# Altium project WiWi_USBStick.PrjPcb (part 2 of 5)

## Sheet 04-AT86RF215IQ.SchDoc
size B; SheetNumber: 5; SheetTotal: 14
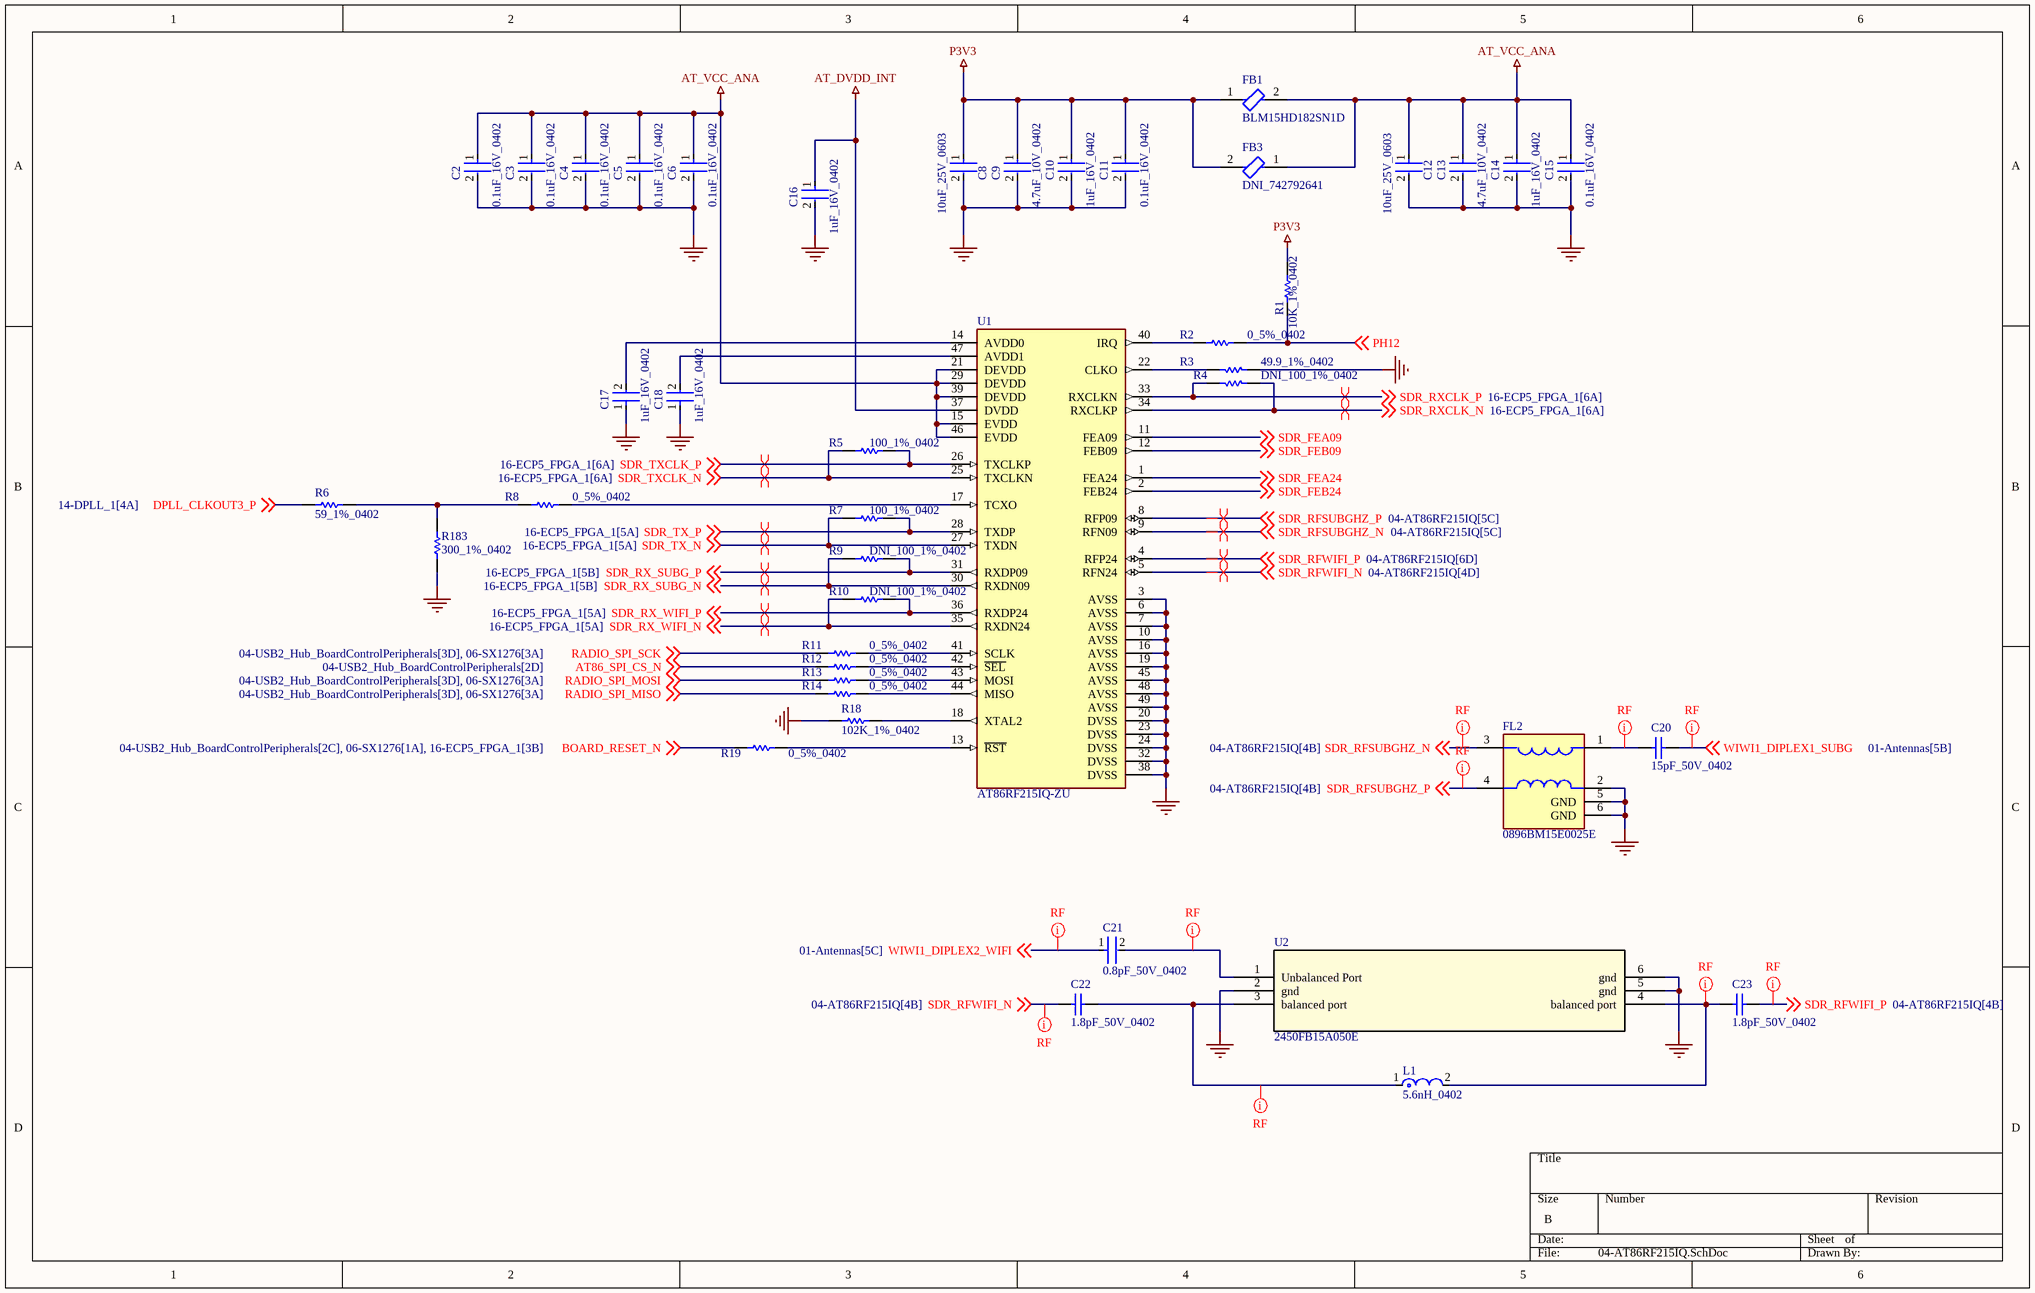
[diagram p4: 04-AT86RF215IQ.SchDoc]

### Parts
C2  0.1uF_16V_0402  [FP-C0402-BB-MFG]
C3  0.1uF_16V_0402  [FP-C0402-BB-MFG]
C4  0.1uF_16V_0402  [FP-C0402-BB-MFG]
C5  0.1uF_16V_0402  [FP-C0402-BB-MFG]
C6  0.1uF_16V_0402  [FP-C0402-BB-MFG]
C8  10uF_25V_0603  [FP-CL10-IPC_C]
C9  4.7uF_10V_0402  [FP-C1005-050-0_15-MFG]
C10  1uF_16V_0402  [FP-0402-L_1_0_0_05-W_0_5-IPC_A]
C11  0.1uF_16V_0402  [FP-C0402-BB-MFG]
C12  10uF_25V_0603  [FP-CL10-IPC_C]
C13  4.7uF_10V_0402  [FP-C1005-050-0_15-MFG]
C14  1uF_16V_0402  [FP-0402-L_1_0_0_05-W_0_5-IPC_A]
C15  0.1uF_16V_0402  [FP-C0402-BB-MFG]
C16  1uF_16V_0402  [FP-0402-L_1_0_0_05-W_0_5-IPC_A]
C17  1uF_16V_0402  [FP-0402-L_1_0_0_05-W_0_5-IPC_A]
C18  1uF_16V_0402  [FP-0402-L_1_0_0_05-W_0_5-IPC_A]
C20  15pF_50V_0402  [CAPC1005X55X25NL05T10]
C21  0.8pF_50V_0402  [FP-GJM155-0_05-IPC_A]
C22  1.8pF_50V_0402  [CAPC1005X55X25LL05T10]
C23  1.8pF_50V_0402  [CAPC1005X55X25LL05T10]
FB1  BLM15HD182SN1D  [FP-BLM15-0_05-MFG]
FB3  DNI_742792641  [FP-742792641-MFG]  (no BOM)
FL2  0896BM15E0025E  [FP-0896BM15E0025E-MFG]
L1  5.6nH_0402  [FP-LQG15HH_02-IPC_A]
R1  10K_1%_0402  [RESC1005X40X25NL10T10]
R2  0_5%_0402  [RESC1005X40X25NL05T10]
R3  49.9_1%_0402  [RESC1005X40X25NL10T10]
R4  DNI_100_1%_0402  [RESC1005X40X25NL05T10]  (no BOM)
R5  100_1%_0402  [RESC1005X40X25NL05T10]
R6  59_1%_0402  [RESC1005X40X25ML10T10]
R7  100_1%_0402  [RESC1005X40X25NL05T10]
R8  0_5%_0402  [RESC1005X40X25NL05T10]
R9  DNI_100_1%_0402  [RESC1005X40X25NL05T10]  (no BOM)
R10  DNI_100_1%_0402  [RESC1005X40X25NL05T10]  (no BOM)
R11  0_5%_0402  [RESC1005X40X25NL05T10]
R12  0_5%_0402  [RESC1005X40X25NL05T10]
R13  0_5%_0402  [RESC1005X40X25NL05T10]
R14  0_5%_0402  [RESC1005X40X25NL05T10]
R18  102K_1%_0402  [RESC1005X40X25ML05T10]
R19  0_5%_0402  [RESC1005X40X25NL05T10]
R183  300_1%_0402  [RESC1005X40X25LL10T10]
U1  AT86RF215IQ-ZU  [FP-AT86RF215IQ-ZU-MFG]
U2  2450FB15A050E  [2450FB15A050E_JOT]

### Nets
AT_DVDD_INT: C16.1 U1.37(DVDD)
AT_VCC_ANA: C2.1 C3.1 C4.1 C5.1 C6.1 C12.1 C13.1 C14.1 C15.1 FB1.2 FB3.1 U1.15(EVDD) U1.21(DEVDD) U1.29(DEVDD) U1.39(DEVDD) U1.46(EVDD)
GND: C2.2 C3.2 C4.2 C5.2 C6.2 C8.2 C9.2 C10.2 C11.2 C12.2 C13.2 C14.2 C15.2 C16.2 C17.1 C18.1 FL2.2(GND) FL2.5(GND) FL2.6(GND) R3.2 R18.1 R183.1 U1.3(AVSS) U1.6(AVSS) U1.7(AVSS) U1.10(AVSS) U1.16(AVSS) U1.19(AVSS) U1.20(DVSS) U1.23(DVSS) U1.24(DVSS) U1.32(DVSS) U1.38(DVSS) U1.45(AVSS) U1.48(AVSS) U1.49(AVSS) U2.2(gnd) U2.5(gnd) U2.6(gnd)
P3V3: C8.1 C9.1 C10.1 C11.1 FB1.1 FB3.2 R1.2
AT86_SPI_CS_N: R12.1 ; off-sheet AT86_SPI_CS_N
BOARD_RESET_N: R19.1 ; off-sheet BOARD_RESET_N
DPLL_CLKOUT3_P: R6.1 ; off-sheet DPLL_CLKOUT3_P
PH12: R1.1 R2.2 ; off-sheet PH12
RADIO_SPI_MISO: R14.1 ; off-sheet RADIO_SPI_MISO
RADIO_SPI_MOSI: R13.1 ; off-sheet RADIO_SPI_MOSI
RADIO_SPI_SCK: R11.1 ; off-sheet RADIO_SPI_SCK
SDR_FEA09: U1.11(FEA09) ; off-sheet SDR_FEA09
SDR_FEA24: U1.1(FEA24) ; off-sheet SDR_FEA24
SDR_FEB09: U1.12(FEB09) ; off-sheet SDR_FEB09
SDR_FEB24: U1.2(FEB24) ; off-sheet SDR_FEB24
SDR_RFSUBGHZ_N: FL2.3(1_Balanced_Port) U1.9(RFN09) ; off-sheet SDR_RFSUBGHZ_N
SDR_RFSUBGHZ_P: FL2.4(2_Balanced_Port) U1.8(RFP09) ; off-sheet SDR_RFSUBGHZ_P
SDR_RFWIFI_N: C22.1 U1.5(RFN24) ; off-sheet SDR_RFWIFI_N
SDR_RFWIFI_P: C23.2 U1.4(RFP24) ; off-sheet SDR_RFWIFI_P
SDR_RX_SUBG_N: R9.1 U1.30(RXDN09) ; off-sheet SDR_RX_SUBG_N
SDR_RX_SUBG_P: R9.2 U1.31(RXDP09) ; off-sheet SDR_RX_SUBG_P
SDR_RX_WIFI_N: R10.1 U1.35(RXDN24) ; off-sheet SDR_RX_WIFI_N
SDR_RX_WIFI_P: R10.2 U1.36(RXDP24) ; off-sheet SDR_RX_WIFI_P
SDR_RXCLK_N: R4.1 U1.34(RXCLKP) ; off-sheet SDR_RXCLK_N
SDR_RXCLK_P: R4.2 U1.33(RXCLKN) ; off-sheet SDR_RXCLK_P
SDR_TX_N: R7.1 U1.27(TXDN) ; off-sheet SDR_TX_N
SDR_TX_P: R7.2 U1.28(TXDP) ; off-sheet SDR_TX_P
SDR_TXCLK_N: R5.1 U1.25(TXCLKN) ; off-sheet SDR_TXCLK_N
SDR_TXCLK_P: R5.2 U1.26(TXCLKP) ; off-sheet SDR_TXCLK_P
WIWI1_DIPLEX1_SUBG: C20.2 ; off-sheet WIWI1_DIPLEX1_SUBG
WIWI1_DIPLEX2_WIFI: C21.1 ; off-sheet WIWI1_DIPLEX2_WIFI
NetC17_2: C17.2 U1.14(AVDD0)
NetC18_2: C18.2 U1.47(AVDD1)
NetC20_1: C20.1 FL2.1(Unbalanced_Port)
NetC21_2: C21.2 U2.1(Unbalanced_Port)
NetC22_2: C22.2 L1.1 U2.3(balanced_port)
NetC23_1: C23.1 L1.2 U2.4(balanced_port)
NetR2_1: R2.1 U1.40(IRQ)
NetR3_1: R3.1 U1.22(CLKO)
NetR6_2: R6.2 R8.1 R183.2
NetR8_2: R8.2 U1.17(TCXO)
NetR11_2: R11.2 U1.41(SCLK)
NetR12_2: R12.2 U1.42(~{SEL})
NetR13_2: R13.2 U1.43(MOSI)
NetR14_2: R14.2 U1.44(MISO)
NetR18_2: R18.2 U1.18(XTAL2)
NetR19_2: R19.2 U1.13(~{RST})

### Layout directives
differential pair: SDR_RFSUBGHZ_N, SDR_RFSUBGHZ_P, SDR_RFWIFI_N, SDR_RFWIFI_P, SDR_RX_SUBG_N, SDR_RX_SUBG_P, SDR_RX_WIFI_N, SDR_RX_WIFI_P, SDR_RXCLK_N, SDR_RXCLK_P, SDR_TX_N, SDR_TX_P, SDR_TXCLK_N, SDR_TXCLK_P
net class RF: NetC20_1, NetC21_2, NetC22_2, NetC23_1, SDR_RFSUBGHZ_N, SDR_RFSUBGHZ_P, SDR_RFWIFI_N, SDR_RFWIFI_P, WIWI1_DIPLEX1_SUBG, WIWI1_DIPLEX2_WIFI

### Library data of the parts
C2-C6 C11 C15 = CMP-1034-02068-3: as C68 on sheet 02-USB3; ComponentLink2URL: https://content.kemet.com/datasheets/KEM_C1002_X7R_SMD.pdf; Automotive: No; Device Class L2: Capacitors; Temperature: -55°C to +125°C; RoHS: TRUE; Voltage Rating: 16 V; ComponentLink2Description: Datasheet; Device Class L3: Ceramic Capacitors; Temperature Range Low: -55°C; Ipc Land Pattern Name: CAPC10050X50; Device Class L1: Passive Components; Temperature Range High: +125°C; Package: C0402-BB; Capacitance: 0.10 μF; Category: Cap; Mouser Description: CAP CER 0.1UF 16V X7R 0402; Height: 0.55mm; Digikey Description: CAP CER 0.1UF 16V 5% X7R 0402; Octopart: https://octopart.com/c0402c104j4ractu-kemet-12573893; Temperature Characteristic: X7R; Lead Free: Yes
C8 C12 = CMP-13271-004224-1: Cap Ceramic 10uF 25V X5R ±20% Pad SMD 0603 +85°C T/R; Width: 0.031inch; Voltage Rating: 25V; Length: 0.063inch; Case Code (Metric): 1608; Dielectric: X5R; Termination: Wraparound; Capacitance: 10uF; Lead Free: Lead Free; Mount: Surface Mount; Package Quantity: 1; Case Code (Imperial): 0603; Thickness: 0.035inch; Packaging: Tape and Reel; Contact Plating: Tin; Min Operating Temperature: -55°C; Tolerance: 20%; Max Operating Temperature: 85°C; Case/Package: 0603
C9 C13 = CMP-2000-05997-2: CAP CER 4.7UF 10V X5R 0402; Dielectric Material: Ceramic; Tolerance: 10%; Series: C; Package Quantity: 10000; Max Operating Temperature: 85°C; Case Code (Imperial): 0402; Lead Free: Lead Free; Voltage Rating (DC): 10V; Packaging: Cut Tape; Voltage Rating: 10V; Min Operating Temperature: -55°C; Dielectric: X5R; Thickness: 0.022inch; Width: 0.02inch; Case/Package: 0402; Case Code (Metric): 1005; Capacitance: 4.7uF; Length: 0.039inch; RoHS Compliant: Yes; REACH SVHC: No SVHC; Mount: Surface Mount
C10 C14 C16-C18 = CMP-14477-000104-2: None; Tolerance: 10%; Voltage Rating: 16V; Dielectric: X5R; Capacitance: 1uF; Packaging: Tape and Reel; Depth: 0.5mm; Mount: Surface Mount; Thickness: 0.022inch; Package Quantity: 1; Min Operating Temperature: -55°C; Series: M; Voltage Rating (DC): 16V; Termination: SMD/SMT; Case/Package: 0402; Number of Pins: 2; Case Code (Imperial): 0402; Length: 1mm; Halogen Free: Halogen Free; Case Code (Metric): 1005; Width: 0.02inch; RoHS Compliant: Yes; Radiation Hardening: No; Max Operating Temperature: 85°C; Height: 0.5mm; Construction: Flat
C20 = CMP-2008-04267-1: Part Number: GRM1555C1H150JZ01D; Manufacturer: Murata
C21 = CMP-2008-03912-2: Multi-Layer Ceramic Capacitor 0.8pF C0G  ±0.1pF 0402 Paper T/R; Voltage: 50V; Height: 0.5mm; Min Operating Temperature: -55°C; Mount: Surface Mount; Length: 1mm; Packaging: Tape and Reel; Package Quantity: 1; Max Operating Temperature: 125°C; Dielectric: C0G; Case Code (Imperial): 0402; Voltage Rating (DC): 50V; Voltage Rating: 50V; Case Code (Metric): 1005; Depth: 0.5mm; Case/Package: 0402; Width: 0.02inch; Termination: SMD/SMT; Thickness: 0.022inch; Capacitance: 0.8pF; Radiation Hardening: No; Lead Free: Lead Free
C22 C23 = CMP-2008-03916-1: Part Number: GRM1555C1H1R8CA01D; Manufacturer: Murata
FB1 = CMP-0686-00276-4: Chip Ferrite Bead, 0402, 1800Ω @ 100MHz, 2.2Ω, 25%, 200mA; Impedance: 1.8kR; Number of Lines: 1; DC Resistance (DCR): 2.2R; Lead Free: Lead Free; Material: Ferrite; REACH SVHC: No SVHC; Current Rating: 200mA; Length: 1mm; Width: 0.5mm; Depth: 0.5mm; Max Operating Temperature: 125°C; Max DC Current: 200mA; Max Current Rating: 200mA; Case Code (Metric): 1005; Package Quantity: 1; Radiation Hardening: No; Number of Pins: 2; Tolerance: 25%; Number of Circuits: 1; Test Frequency: 100MHz; Termination: SMD/SMT; Military Standard: Not; Core Material: Ferrite; Height: 0.5mm; Case Code (Imperial): 0402; Packaging: Tape and Reel; Case/Package: 0402; DC Current: 200mA; Min Operating Temperature: -55°C
FB3 = CMP-0220-00171-2: FERRITE BEAD 300 OHM 0603 1LN; Inductance: 18nH; Max DC Current: 2A; Number of Lines: 1; Test Frequency: 100MHz; Impedance: 300R; DC Resistance (DCR): 150mR; Tolerance: 25%; Case Code (Metric): 1608; Core Material: Ferrite; Length: 1.6mm; Lead Free: Lead Free; Series: WE-CBF; Min Operating Temperature: -55°C; RoHS Compliant: Yes; Case/Package: SMD/SMT; Material: Ferrite; Max Operating Temperature: 125°C; Termination: SMD/SMT; Packaging: Tape and Reel; Weight: 0.000141oz; Case Code (Imperial): 0603; Width: 0.8mm; Mount: Surface Mount; Max Current Rating: 2A; Package Quantity: 1; Depth: 0.8mm; Current Rating: 2A; Height: 0.8mm
FL2 = CMP-56495-000001-1: BALUN 863MHZ-928MHZ 50/50 0805; Manufacturer: Johanson; Insertion Loss: 1.8dB; Frequency: 895.5MHz; Bandwidth: 863-928MHz; Filter Type: Low Pass; Automotive: No; Manufacturer Part Number: 0896BM15E0025E; Temperature Range Low: -40°C; Height: 1.05mm; Digikey Description: BALUN 863MHZ-928MHZ 50/50 0805; Mouser Description: Signal Conditioning 863/928MHz BALUN/FILTER; Category: Filter; ComponentLink2Description: Datasheet; Temperature: -40°C to +125°C; Lead Free: Yes; Temperature Range High: +125°C; ComponentLink2URL: https://www.johansontechnology.com/datasheets/0896BM15E0025/0896BM15E0025.pdf; Package: 0896BM15E0025E; Device Class L2: EMI / RFI Components; Device Class L3: RF; RoHS: TRUE; Octopart: https://octopart.com/0896bm15e0025e-johanson-71691697; Device Class L1: Passive Components
L1 = CMP-06042-000284-1: Multilayer type RF Inductor 5.6nH ±0.3nH 0.18Ω 600mA 0402; Core Material: Air; DC Current: 300mA; Shielding: Unshielded; Test Frequency: 100MHz; Self Resonant Frequency: 5.3GHz; Q Factor: 8; DC Resistance (DCR): 260mR; Package Quantity: 1; Number of Pins: 2; Height: 0.02inch; Mount: Surface Mount; Termination: SMD/SMT; Case/Package: 0402; Case Code (Metric): 1005; Packaging: Tape and Reel; Min Operating Temperature: -55°C; Max DC Current: 300mA; Width: 0.02inch; Case Code (Imperial): 0402; Lead Free: Lead Free; Inductance: 5.6nH; Max Operating Temperature: 125°C; REACH SVHC: No SVHC; Radiation Hardening: No; Height - Seated (Max): 0.022inch; Depth: 0.55mm; Military Standard: Not; Length: 1mm; Current Rating: 300mA
R1 = CMP-2002-04694-1: as R40 on sheet 02-USB3
R2 R8 R11-R14 R19 = CMP-2002-06457-1: as R94 on sheet 02-USB3
R3 = CMP-2002-04448-1: Part Number: RK73H1ETTP49R9F; Manufacturer: KOA Speer
R4 R5 R7 R9 R10 = CMP-2002-07853-1: Manufacturer: Yageo; Part Number: RC0402FR-13100RL
R6 = CMP-2002-04479-1: Manufacturer: KOA Speer; Part Number: RK73H1ETTP59R0F
R18 = CMP-2002-07345-1: Manufacturer: Yageo; Part Number: RC0402FR-07102KL
R183 = CMP-2002-06121-1: Part Number: MC00625W04021300R; Manufacturer: Multicomp
U1 = CMP-06331-000021-1: IC RF TXRX 802.15.4 48VFQFN; Manufacturer: Microchip; Data Rate: 2.4Mbits/s; Min Supply Voltage: 1.8V; Standoff Height: 0mm; Interface: SPI,Other; Sensitivity: -123dBm; Max Supply Voltage: 3.6V; Max Frequency: 2483.5MHz; Temperature Range High: +85°C; ComponentLink2URL: http://ww1.microchip.com/downloads/en/devicedoc/atmel-42415-wireless-at86rf215_datasheet.pdf; Lead Free: Yes; Digikey Description: IC RF TXRX 802.15.4 48VFQFN; Temperature: -40°C to +85°C; RoHS: TRUE; ComponentLink2Description: Datasheet; Height: 0.9mm; Temperature Range Low: -40°C; Manufacturer Part Number: AT86RF215IQ-ZU; Footprint Url: http://ww1.microchip.com/downloads/en/appnotes/atmel-8826-seeprom-pcb-mounting-guidelines-surface-mount-packages-applicationnote.pdf; Category: IC; Automotive: No; Ipc Land Pattern Name: QFN50P700X700X85-48; Device Class L1: Integrated Circuits (ICs); Octopart: https://octopart.com/at86rf215iq-zu-microchip-77758620; Package: QFN48; Device Class L2: RF Semiconductors and Devices; Device Class L3: Transceivers
U2 = 2450FB15A050E: No Description Available; Mfr_Name: Johanson Technology; RefDes: RefDes; Type: Type

## Sheet 06-SX1276.SchDoc
size B; SheetNumber: 6; SheetTotal: 14
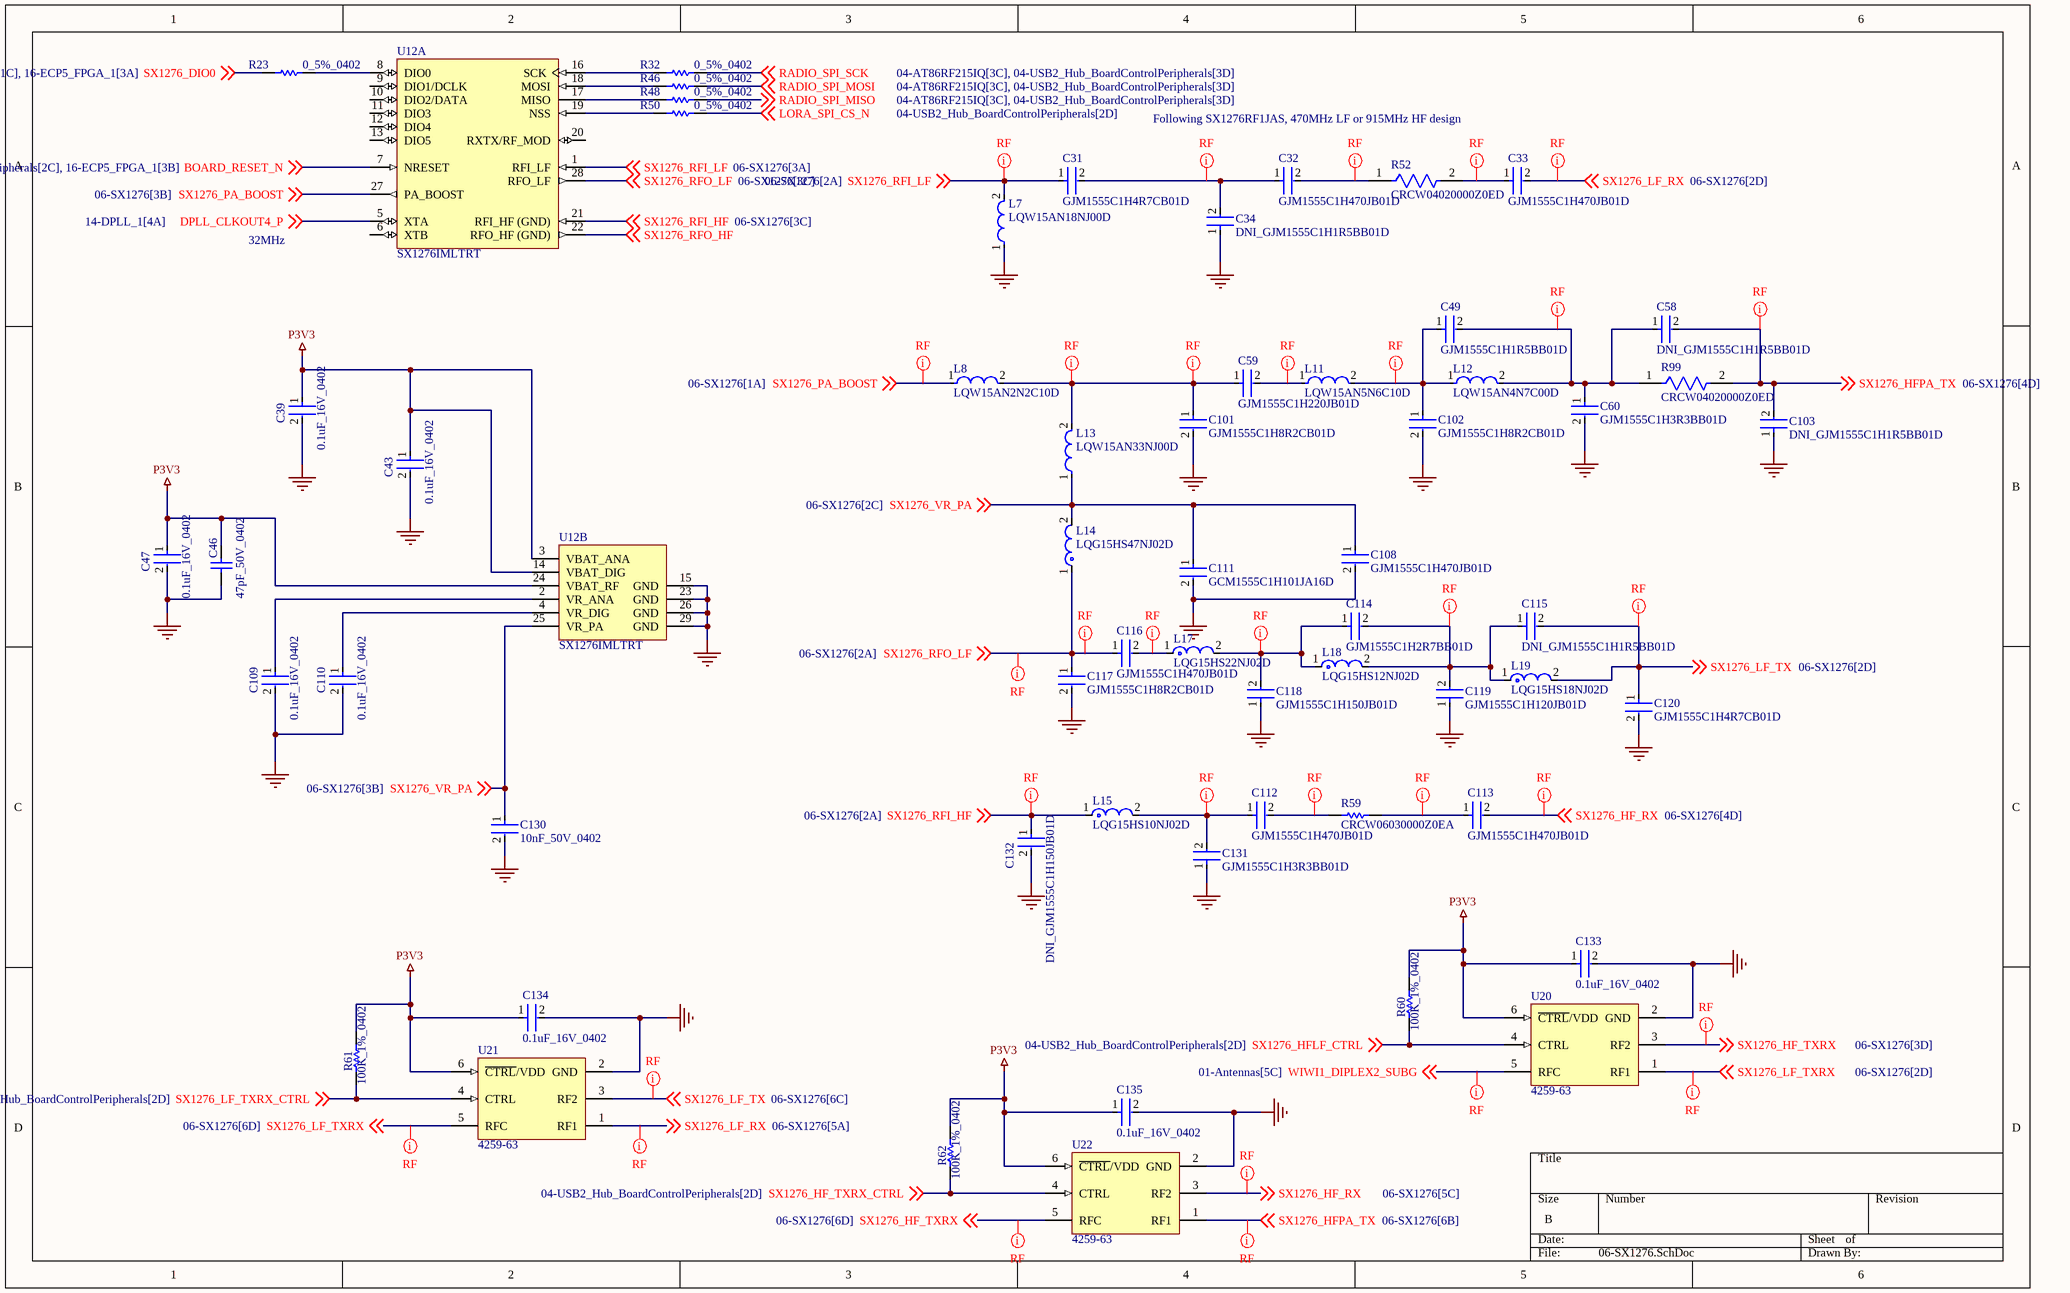
[diagram p5: 06-SX1276.SchDoc]

### Parts
C31  GJM1555C1H4R7CB01D  [FP-GJM155-0_05-IPC_B]
C32  GJM1555C1H470JB01D  [FP-GJM155-0_05-MFG]
C33  GJM1555C1H470JB01D  [FP-GJM155-0_05-MFG]
C34  DNI_GJM1555C1H1R5BB01D  [FP-GJM155-0_05-IPC_C]  (no BOM)
C39  0.1uF_16V_0402  [FP-C0402-BB-MFG]
C43  0.1uF_16V_0402  [FP-C0402-BB-MFG]
C46  47pF_50V_0402  [CAPC1005X55X25LL05T10]
C47  0.1uF_16V_0402  [FP-C0402-BB-MFG]
C49  GJM1555C1H1R5BB01D  [FP-GJM155-0_05-IPC_C]
C58  DNI_GJM1555C1H1R5BB01D  [FP-GJM155-0_05-IPC_C]  (no BOM)
C59  GJM1555C1H220JB01D  [FP-GJM155-0_05-IPC_C]
C60  GJM1555C1H3R3BB01D  [FP-GJM155-0_05-IPC_C]
C101  GJM1555C1H8R2CB01D  [FP-GJM155-0_05-IPC_C]
C102  GJM1555C1H8R2CB01D  [FP-GJM155-0_05-IPC_C]
C103  DNI_GJM1555C1H1R5BB01D  [FP-GJM155-0_05-IPC_C]  (no BOM)
C108  GJM1555C1H470JB01D  [FP-GJM155-0_05-MFG]
C109  0.1uF_16V_0402  [FP-C0402-BB-MFG]
C110  0.1uF_16V_0402  [FP-C0402-BB-MFG]
C111  GCM1555C1H101JA16D  [FP-GCM155-0_05-IPC_C]
C112  GJM1555C1H470JB01D  [FP-GJM155-0_05-MFG]
C113  GJM1555C1H470JB01D  [FP-GJM155-0_05-MFG]
C114  GJM1555C1H2R7BB01D  [FP-GJM155-0_05-IPC_A]
C115  DNI_GJM1555C1H1R5BB01D  [FP-GJM155-0_05-IPC_C]  (no BOM)
C116  GJM1555C1H470JB01D  [FP-GJM155-0_05-MFG]
C117  GJM1555C1H8R2CB01D  [FP-GJM155-0_05-IPC_C]
C118  GJM1555C1H150JB01D  [FP-GJM155-0_05-IPC_A]
C119  GJM1555C1H120JB01D  [FP-GJM155-0_05-IPC_A]
C120  GJM1555C1H4R7CB01D  [FP-GJM155-0_05-IPC_B]
C130  10nF_50V_0402  [FP-CL165-IPC_C]
C131  GJM1555C1H3R3BB01D  [FP-GJM155-0_05-IPC_C]
C132  DNI_GJM1555C1H150JB01D  [FP-GJM155-0_05-IPC_A]  (no BOM)
C133  0.1uF_16V_0402  [FP-C0402-BB-MFG]
C134  0.1uF_16V_0402  [FP-C0402-BB-MFG]
C135  0.1uF_16V_0402  [FP-C0402-BB-MFG]
L7  LQW15AN18NJ00D  [FP-LQW15AN_00-W0_6-0_1-MFG]
L8  LQW15AN2N2C10D  [FP-LQW15AN_00-W0_6-0_1-MFG]
L11  LQW15AN5N6C10D  [FP-LQW15AN_00-W0_6-0_1-MFG]
L12  LQW15AN4N7C00D  [FP-LQW15AN_00-W0_6-0_1-MFG]
L13  LQW15AN33NJ00D  [FP-LQW15AN_00-W0_5-0_1-MFG]
L14  LQG15HS47NJ02D  [FP-LQG15HH_02-IPC_B]
L15  LQG15HS10NJ02D  [FP-LQG15HH_02-IPC_A]
L17  LQG15HS22NJ02D  [FP-LQG15HH_02-MFG]
L18  LQG15HS12NJ02D  [FP-LQG15HH_02-IPC_A]
L19  LQG15HS18NJ02D  [FP-LQG15HH_02-MFG]
R23  0_5%_0402  [RESC1005X40X25NL05T10]
R32  0_5%_0402  [RESC1005X40X25NL05T10]
R46  0_5%_0402  [RESC1005X40X25NL05T10]
R48  0_5%_0402  [RESC1005X40X25NL05T10]
R50  0_5%_0402  [RESC1005X40X25NL05T10]
R52  CRCW04020000Z0ED  [FP-CRCW0402-e3-IPC_C]
R59  CRCW06030000Z0EA  [RESC1609X50X30NL8T20]
R60  100K_1%_0402  [RESC1005X40X25ML05T10]
R61  100K_1%_0402  [RESC1005X40X25ML05T10]
R62  100K_1%_0402  [RESC1005X40X25ML05T10]
R99  CRCW04020000Z0ED  [FP-CRCW0402-e3-IPC_C]
U12  SX1276IMLTRT  [SMTC-QFN-28_V]  (parts A,B of 2)
U20  4259-63  [PERE-SC-70-6_M]
U21  4259-63  [PERE-SC-70-6_M]
U22  4259-63  [PERE-SC-70-6_M]

### Nets
GND: C34.1 C39.2 C43.2 C46.1 C47.2 C60.2 C101.2 C102.2 C103.1 C108.2 C109.2 C110.2 C111.2 C117.2 C118.1 C119.1 C120.2 C130.2 C131.1 C132.2 C133.2 C134.2 C135.2 L7.1 U12.15(GND) U12.23(GND) U12.26(GND) U12.29(GND) U20.2(GND) U21.2(GND) U22.2(GND)
P3V3: C39.1 C43.1 C46.2 C47.1 C133.1 C134.1 C135.1 R60.2 R61.2 R62.2 U12.3(VBAT_ANA) U12.14(VBAT_DIG) U12.24(VBAT_RF) U20.6(~{CTRL}/VDD) U21.6(~{CTRL}/VDD) U22.6(~{CTRL}/VDD)
BOARD_RESET_N: U12.7(NRESET) ; off-sheet BOARD_RESET_N
DPLL_CLKOUT4_P: U12.5(XTA) ; off-sheet DPLL_CLKOUT4_P
LORA_SPI_CS_N: R50.2 ; off-sheet LORA_SPI_CS_N
RADIO_SPI_MISO: R48.2 ; off-sheet RADIO_SPI_MISO
RADIO_SPI_MOSI: R46.2 ; off-sheet RADIO_SPI_MOSI
RADIO_SPI_SCK: R32.2 ; off-sheet RADIO_SPI_SCK
SX1276_DIO0: R23.1 ; off-sheet SX1276_DIO0
SX1276_HF_RX: C113.2 U22.3(RF2) ; off-sheet SX1276_HF_RX
SX1276_HF_TXRX: U20.3(RF2) U22.5(RFC) ; off-sheet SX1276_HF_TXRX
SX1276_HF_TXRX_CTRL: R62.1 U22.4(CTRL) ; off-sheet SX1276_HF_TXRX_CTRL
SX1276_HFLF_CTRL: R60.1 U20.4(CTRL) ; off-sheet SX1276_HFLF_CTRL
SX1276_HFPA_TX: C58.2 C103.2 R99.2 U22.1(RF1) ; off-sheet SX1276_HFPA_TX
SX1276_LF_RX: C33.2 U21.1(RF1) ; off-sheet SX1276_LF_RX
SX1276_LF_TX: C115.2 C120.1 L19.2 U21.3(RF2) ; off-sheet SX1276_LF_TX
SX1276_LF_TXRX: U20.1(RF1) U21.5(RFC) ; off-sheet SX1276_LF_TXRX
SX1276_LF_TXRX_CTRL: R61.1 U21.4(CTRL) ; off-sheet SX1276_LF_TXRX_CTRL
SX1276_PA_BOOST: L8.1 U12.27(PA_BOOST) ; off-sheet SX1276_PA_BOOST
SX1276_RFI_HF: C132.1 L15.1 U12.21(RFI_HF_(GND)) ; off-sheet SX1276_RFI_HF
SX1276_RFI_LF: C31.1 L7.2 U12.1(RFI_LF) ; off-sheet SX1276_RFI_LF
SX1276_RFO_HF: U12.22(RFO_HF_(GND)) ; off-sheet SX1276_RFO_HF
SX1276_RFO_LF: C116.1 C117.1 L14.1 U12.28(RFO_LF) ; off-sheet SX1276_RFO_LF
SX1276_VR_PA: C108.1 C111.1 C130.1 L13.1 L14.2 U12.25(VR_PA) ; off-sheet SX1276_VR_PA
WIWI1_DIPLEX2_SUBG: U20.5(RFC) ; off-sheet WIWI1_DIPLEX2_SUBG
NetC31_2: C31.2 C32.1 C34.2
NetC32_2: C32.2 R52.1
NetC33_1: C33.1 R52.2
NetC49_1: C49.1 C102.1 L11.2 L12.1
NetC49_2: C49.2 C58.1 C60.1 L12.2 R99.1
NetC59_1: C59.1 C101.1 L8.2 L13.2
NetC59_2: C59.2 L11.1
NetC109_1: C109.1 U12.2(VR_ANA)
NetC110_1: C110.1 U12.4(VR_DIG)
NetC112_1: C112.1 C131.2 L15.2
NetC112_2: C112.2 R59.1
NetC113_1: C113.1 R59.2
NetC114_1: C114.1 C118.2 L17.2 L18.1
NetC114_2: C114.2 C115.1 C119.2 L18.2 L19.1
NetC116_2: C116.2 L17.1
NetR23_2: R23.2 U12.8(DIO0)
NetR32_1: R32.1 U12.16(SCK)
NetR46_1: R46.1 U12.18(MOSI)
NetR48_1: R48.1 U12.17(MISO)
NetR50_1: R50.1 U12.19(NSS)

Not connected (* = marked no-connect by the designer): U12 6(XTB) 9(DIO1/DCLK) 10(DIO2/DATA) 11(DIO3) 12(DIO4) 13(DIO5) 20(RXTX/RF_MOD)

### Layout directives
net class RF: NetC31_2, NetC32_2, NetC33_1, NetC49_1, NetC49_2, NetC59_1, NetC59_2, NetC112_1, NetC112_2, NetC113_1, NetC114_1, NetC114_2, NetC116_2, SX1276_HF_RX, SX1276_HF_TXRX, SX1276_HFPA_TX, SX1276_LF_RX, SX1276_LF_TX, SX1276_LF_TXRX, SX1276_PA_BOOST, SX1276_RFI_HF, SX1276_RFI_LF, SX1276_RFO_LF, WIWI1_DIPLEX2_SUBG

### Notes on the sheet
- Following SX1276RF1JAS, 470MHz LF or 915MHz HF design
- 32MHz

### Library data of the parts
C31 C120 = CMP-2008-03859-2: Multi-Layer Ceramic Capacitor 4.7pF C0G  ±0.25pF 0402 Paper T/R; Voltage Rating (DC): 50V; Temperature Coefficient: 30ppm/°C; Case/Package: 0402; Packaging: Tape and Reel; Package Quantity: 10000; Depth: 0.5mm; REACH SVHC: No SVHC; Height: 0.5mm; Lead Free: Lead Free; Number of Pins: 2; Case Code (Imperial): 0402; Width: 0.02inch; Max Operating Temperature: 125°C; Capacitance: 4.7pF; Dielectric: C0G; Lead Pitch: 0.3mm; Voltage Rating: 50V; Min Operating Temperature: -55°C; Thickness: 0.022inch; Voltage: 50V; Radiation Hardening: No; Mount: Surface Mount; Termination: SMD/SMT; Case Code (Metric): 1005; Length: 1mm
C32 C33 C108 C112 C113 C116 = CMP-06035-013708-1: Multi-Layer Ceramic Capacitor 47pF C0G  ±5% 0402 Paper T/R; Voltage Rating (DC): 50V; Capacitance: 47pF; Tolerance: 5%; Dielectric: C0G; Thickness: 500um; Length: 1mm; Width: 500um
C34 C49 C58 C103 C115 = CMP-2008-03820-2: Multi-Layer Ceramic Capacitor 1.5pF C0G  ±0.1pF 0402 Paper T/R; Temperature Coefficient: 30ppm/°C; Voltage Rating: 50V; Depth: 0.5mm; Case Code (Imperial): 0402; Package Quantity: 10000; Length: 1mm; Number of Pins: 2; Max Operating Temperature: 125°C; Mount: Surface Mount; Construction: Flat; Thickness: 0.022inch; Series: GJM; Packaging: Tape and Reel; Radiation Hardening: No; REACH SVHC: No SVHC; Case/Package: 0402; Lead Free: Lead Free; Voltage Rating (DC): 50V; Min Operating Temperature: -55°C; Dielectric: C0G; Termination: SMD/SMT; Width: 0.5mm; Capacitance: 1.5pF; Lead Pitch: 0.3mm; Case Code (Metric): 1005; Voltage: 50V; Height: 0.5mm
C39 C43 C47 C109 C110 C133-C135 = CMP-1034-02068-3: as C68 on sheet 02-USB3; ComponentLink2URL: https://content.kemet.com/datasheets/KEM_C1002_X7R_SMD.pdf; Automotive: No; Device Class L2: Capacitors; Temperature: -55°C to +125°C; RoHS: TRUE; Voltage Rating: 16 V; ComponentLink2Description: Datasheet; Device Class L3: Ceramic Capacitors; Temperature Range Low: -55°C; Ipc Land Pattern Name: CAPC10050X50; Device Class L1: Passive Components; Temperature Range High: +125°C; Package: C0402-BB; Capacitance: 0.10 μF; Category: Cap; Mouser Description: CAP CER 0.1UF 16V X7R 0402; Height: 0.55mm; Digikey Description: CAP CER 0.1UF 16V 5% X7R 0402; Octopart: https://octopart.com/c0402c104j4ractu-kemet-12573893; Temperature Characteristic: X7R; Lead Free: Yes
C46 = CMP-2008-04368-1: Part Number: GRM1555C1H470JA01D; Manufacturer: Murata
C59 = CMP-06035-006261-1: Multi-Layer Ceramic Capacitor 22pF C0G  ±5% 0402 Paper T/R; Voltage Rating (DC): 50V; Length: 1mm; Width: 500um; Dielectric: C0G; Capacitance: 22pF; Thickness: 500um; Tolerance: 5%
C60 C131 = CMP-2008-03846-2: Multi-Layer Ceramic Capacitor 3.3pF C0G  ±0.1pF 0402 Paper T/R; Voltage: 50V; Lead Free: Lead Free; Thickness: 0.022inch; Mount: Surface Mount; Termination: SMD/SMT; Package Quantity: 1; Lead Pitch: 0.3mm; Case/Package: 0402; REACH SVHC: No SVHC; Case Code (Imperial): 0402; Number of Pins: 2; Height: 0.5mm; Width: 0.5mm; Depth: 0.5mm; Capacitance: 3.3pF; Packaging: Tape and Reel; Min Operating Temperature: -55°C; Length: 1mm; Dielectric: C0G; Case Code (Metric): 1005; Max Operating Temperature: 125°C; Voltage Rating (DC): 50V; Voltage Rating: 50V; Radiation Hardening: No
C101 C102 C117 = CMP-2008-03886-2: Multi-Layer Ceramic Capacitor 8.2pF C0G  ±0.25pF 0402 Paper T/R; Temperature Coefficient: 30ppm/°C; Voltage: 50V; Case Code (Metric): 1005; Max Operating Temperature: 125°C; Dielectric: C0G; Lead Free: Lead Free; Case/Package: 0402; Radiation Hardening: No; Length: 1mm; Thickness: 0.022inch; Case Code (Imperial): 0402; Number of Pins: 2; Depth: 0.5mm; Mount: Surface Mount; Termination: SMD/SMT; Voltage Rating (DC): 50V; Package Quantity: 1; Packaging: Tape and Reel; REACH SVHC: No SVHC; Min Operating Temperature: -55°C; Height: 0.5mm; Lead Pitch: 0.3mm; Capacitance: 8.2pF; Width: 0.5mm; Voltage Rating: 50V
C111 = CMP-2008-03694-3: Ceramic Capacitor for Automotive 100pF ±5% 50VDC C0G 0402 Paper T/R; Voltage: 50V; Ratings: AEC-Q200; Radiation Hardening: No; Min Operating Temperature: -55°C; Capacitance: 100pF; Depth: 0.5mm; Max Operating Temperature: 125°C; Length: 1mm; Height: 0.5mm; Termination: SMD/SMT; Voltage Rating: 50V; Dielectric: C0G; Package Quantity: 10000; Case Code (Imperial): 0402; Width: 0.02inch; Case/Package: 0402; Lead Free: Lead Free; Case Code (Metric): 1005; Voltage Rating (DC): 50V; Thickness: 0.022inch; Mount: Surface Mount; Tolerance: 5%; REACH SVHC: No SVHC; Weight: 0.000212oz; Packaging: Tape and Reel
C114 = CMP-2008-03840-2: Multi-Layer Ceramic Capacitor 2.7pF C0G  ±0.1pF 0402 Paper T/R; Voltage Rating (DC): 50V; Temperature Coefficient: 30ppm/°C; Max Operating Temperature: 125°C; Lead Free: Lead Free; REACH SVHC: No SVHC; Thickness: 0.022inch; Length: 1mm; Height: 0.5mm; Min Operating Temperature: -55°C; Mount: Surface Mount; Case/Package: 0402; Case Code (Imperial): 0402; Width: 0.02inch; Capacitance: 2.7pF; Packaging: Tape and Reel; Package Quantity: 10000; Lead Pitch: 0.3mm; Dielectric: C0G; Depth: 0.5mm; Voltage Rating: 50V; Radiation Hardening: No; Termination: SMD/SMT; Voltage: 50V; Number of Pins: 2; Case Code (Metric): 1005
C118 C132 = CMP-2008-03804-2: Multi-Layer Ceramic Capacitor 15pF C0G  ±5% 0402 Paper T/R; Voltage Rating (DC): 50V; Temperature Coefficient: 30ppm/°C; Dielectric: C0G; Max Operating Temperature: 125°C; Radiation Hardening: No; REACH SVHC: No SVHC; Case Code (Imperial): 0402; Package Quantity: 1; Thickness: 0.022inch; Min Operating Temperature: -55°C; Mount: Surface Mount; Tolerance: 5%; Voltage Rating: 50V; Depth: 0.5mm; Width: 0.02inch; Height: 0.5mm; Number of Pins: 2; Case Code (Metric): 1005; Lead Pitch: 0.3mm; Case/Package: 0402; Termination: SMD/SMT; Voltage: 50V; Length: 1mm; Capacitance: 15pF; Packaging: Tape and Reel; Lead Free: Lead Free
C119 = CMP-2008-03800-2: Multi-Layer Ceramic Capacitor 12pF C0G  ±5% 0402 Paper T/R; Voltage: 50V; Temperature Coefficient: 30ppm/°C; Tolerance: 5%; Package Quantity: 1; Dielectric: C0G; Height: 0.5mm; Voltage Rating: 50V; Radiation Hardening: No; Capacitance: 12pF; REACH SVHC: No SVHC; Voltage Rating (DC): 50V; Number of Pins: 2; Depth: 0.5mm; Mount: Surface Mount; Lead Free: Lead Free; Lead Pitch: 0.3mm; Width: 0.5mm; Min Operating Temperature: -55°C; Length: 1mm; Case/Package: 0402; Thickness: 0.022inch; Case Code (Metric): 1005; Packaging: Tape and Reel; Max Operating Temperature: 125°C; Case Code (Imperial): 0402; Termination: SMD/SMT
C130 = CMP-13271-000387-1: Cap Ceramic 10nF 50V X7R ±10% SMD 0402 +125°C Paper T/R; Depth: 0.5mm; Length: 1mm; Lead Free: Lead Free; Case Code (Metric): 1005; Width: 0.02inch; Min Operating Temperature: -55°C; Thickness: 0.022inch; Package Quantity: 1; Mount: Surface Mount; Height: 0.5mm; Voltage: 50V; Material: Ceramic; Tolerance: 10%; Case Code (Imperial): 0402; Radiation Hardening: No; Case/Package: 0402; Max Operating Temperature: 125°C; Voltage Rating (DC): 50V; Contact Plating: Tin; Packaging: Tape and Reel; Voltage Rating: 50V; Capacitance: 10nF; Dielectric: X7R
L7 = CMP-06042-006916-1: Wire Wound RF Inductor 18nH ±5% 370mA 0.27Ω 0402 (1005); Q Factor: 25; DC Resistance (DCR): 270mR; Test Frequency: 100MHz; Self Resonant Frequency: 4.5GHz; Core Material: Air; Shielding: Unshielded; Inductance: 18nH; Lead Free: Lead Free; Resistor Type: Wirewound; Height: 0.5mm; Width: 0.02inch; Max DC Current: 370mA; Case/Package: 0402; Radiation Hardening: No; Min Operating Temperature: -55°C; Packaging: Tape and Reel; DC Current: 370mA; Tolerance: 5%; Max Operating Temperature: 125°C; Weight: 2.8E-05oz; Current Rating: 370mA; Military Standard: Not; Termination: SMD/SMT; Length: 1mm; Case Code (Metric): 1005; Mount: Surface Mount; Case Code (Imperial): 0402; Package Quantity: 10000; Depth: 0.7mm
L8 = CMP-06042-008786-1: Wire Wound RF Inductor 2.2nH ±0.2nH 1000mA 0.027Ω 0402 (1005); Q Factor: 25; Current Rating: 1A; Core Material: Air; Test Frequency: 100MHz; Shielding: Unshielded; DC Resistance (DCR): 27mR; Self Resonant Frequency: 14GHz; Min Operating Temperature: -55°C; Package Quantity: 10000; Length: 1mm; Number of Pins: 2; Radiation Hardening: No; Case Code (Metric): 1005; Termination: SMD/SMT; Inductance: 2.2nH; Mount: Surface Mount; DC Current: 1A; Military Standard: Not; Max Operating Temperature: 125°C; Max DC Current: 1A; Lead Free: Lead Free; Depth: 0.7mm; Case/Package: 0402; Packaging: Tape and Reel; Height: 0.5mm; Width: 0.5mm; REACH SVHC: No SVHC; Weight: 2.8E-05oz; Case Code (Imperial): 0402
L11 = CMP-06042-014099-1: Wire Wound RF Inductor 5.6nH ±0.2nH 800mA 0.051Ω 0402 (1005); DC Resistance (DCR): 51mR; Self Resonant Frequency: 8GHz; Shielding: Unshielded; Core Material: Air; Q Factor: 30; Test Frequency: 100MHz; Depth: 0.7mm; Weight: 2.8E-05oz; Width: 0.5mm; Height: 0.5mm; DC Current: 800mA; Packaging: Tape and Reel; Max DC Current: 800mA; Case Code (Metric): 1005; Military Standard: Not; Case/Package: 0402; Inductance: 5.6nH; Package Quantity: 1; Termination: SMD/SMT; Resistor Type: Wirewound; Mount: Surface Mount; Lead Free: Lead Free; Min Operating Temperature: -55°C; Number of Pins: 2; REACH SVHC: No SVHC; Radiation Hardening: No; Length: 1mm; Current Rating: 800mA; Case Code (Imperial): 0402; Max Operating Temperature: 125°C
L12 = CMP-06042-000468-1: Wire Wound RF Inductor 4.7nH ±0.2nH 750mA 0.07Ω 0402 (1005); Q Factor: 25; Core Material: Air; Test Frequency: 100MHz; DC Resistance (DCR): 70mR; Self Resonant Frequency: 8GHz; Shielding: Unshielded; Packaging: Tape and Reel; Termination: SMD/SMT; Length: 1mm; Lead Free: Lead Free; Min Operating Temperature: -55°C; Height: 0.5mm; Military Standard: Not; Case Code (Metric): 1005; Width: 0.02inch; Inductance: 4.7nH; Case Code (Imperial): 0402; REACH SVHC: No SVHC; Weight: 2.8E-05oz; Current Rating: 750mA; Max Operating Temperature: 125°C; Number of Pins: 2; Package Quantity: 10000; Radiation Hardening: No; DC Current: 750mA; Max DC Current: 750mA; Case/Package: 0402; Depth: 0.7mm; Mount: Surface Mount
L13 = CMP-06042-007456-1: Wire Wound RF Inductor 33nH ±5% 260mA 0.63Ω 0402 (1005); Test Frequency: 100MHz; Core Material: Air; Shielding: Unshielded; Q Factor: 25; Self Resonant Frequency: 3.2GHz; DC Resistance (DCR): 630mR; Width: 0.5mm; Tolerance: 5%; Case Code (Imperial): 0402; Max Operating Temperature: 125°C; Inductance: 33nH; Weight: 2.8E-05oz; Case Code (Metric): 1005; Lead Free: Lead Free; Case/Package: 0402; Max DC Current: 260mA; Military Standard: Not; Length: 1mm; Packaging: Tape and Reel; Mount: Surface Mount; Package Quantity: 10000; Min Operating Temperature: -55°C; Resistor Type: Wirewound; Radiation Hardening: No; Height: 0.5mm; Termination: SMD/SMT; DC Current: 260mA; Current Rating: 260mA; Depth: 0.6mm
L14 = CMP-06042-015783-1: Multilayer type RF Inductor 47nH ±5% 0.72Ω 300mA 0402; Core Material: Air; DC Resistance (DCR): 720mR; DC Current: 200mA; Shielding: Unshielded; Self Resonant Frequency: 1GHz; Q Factor: 8; Test Frequency: 100MHz; Tolerance: 5%; Packaging: Tape and Reel; Case Code (Imperial): 0402; Max Operating Temperature: 125°C; Military Standard: Not; Length: 1mm; Radiation Hardening: No; Height: 0.5mm; Min Operating Temperature: -55°C; Width: 0.02inch; Inductance: 47nH; Lead Free: Lead Free; Termination: SMD/SMT; Height - Seated (Max): 0.022inch; Rated Current-Max: 200mA; Case/Package: 0402; Max DC Current: 200mA; Series: LQG15HS; Case Code (Metric): 1005; Mount: Surface Mount; Current Rating: 200mA; Depth: 0.55mm; Package Quantity: 1
L15 = CMP-06042-014117-1: Multilayer type RF Inductor 10nH ±5% 0.26Ω 500mA 0402; DC Resistance (DCR): 260mR; DC Current: 300mA; Shielding: Unshielded; Q Factor: 8; Test Frequency: 100MHz; Self Resonant Frequency: 3.4GHz; Core Material: Air; Width: 0.5mm; Radiation Hardening: No; Packaging: Tape and Reel; Lead Free: Lead Free; Military Standard: Not; Case/Package: 0402; Current Rating: 300mA; Case Code (Metric): 1005; Length: 0.039inch; Termination: SMD/SMT; Max DC Current: 300mA; Max Operating Temperature: 125°C; Mount: Surface Mount; Height - Seated (Max): 0.022inch; Package Quantity: 10000; Height: 0.5mm; Inductance: 10nH; Tolerance: 5%; Case Code (Imperial): 0402; Depth: 0.55mm; Min Operating Temperature: -55°C
L17 = CMP-06042-006776-1: Multilayer type RF Inductor 22nH ±5% 0.42Ω 350mA 0402; Current Rating: 300mA; Core Material: Air; Test Frequency: 100MHz; Self Resonant Frequency: 1.9GHz; Q Factor: 8; Shielding: Unshielded; DC Resistance (DCR): 420mR; Mount: Surface Mount; Lead Free: Lead Free; Military Standard: Not; Height - Seated (Max): 0.022inch; Case Code (Imperial): 0402; Length: 1mm; Max Operating Temperature: 125°C; Case/Package: 0402; Width: 0.02inch; Tolerance: 5%; Case Code (Metric): 1005; Min Operating Temperature: -55°C; Max DC Current: 300mA; Height: 0.5mm; Radiation Hardening: No; Depth: 0.55mm; Packaging: Tape and Reel; Termination: SMD/SMT; DC Current: 300mA; Inductance: 22nH; Package Quantity: 10000
L18 = CMP-2000-06576-2: Multilayer type RF Inductor 12nH ±5% 0.28Ω 500mA 0402; Self Resonant Frequency: 3GHz; Current Rating: 300mA; Core Material: Air; Shielding: Unshielded; Q Factor: 8; Test Frequency: 100MHz; DC Resistance (DCR): 280mR; Mount: Surface Mount; Width: 0.5mm; Tolerance: 5%; Lead Free: Lead Free; Max Operating Temperature: 125°C; Height - Seated (Max): 0.022inch; Case Code (Metric): 1005; Min Operating Temperature: -55°C; Depth: 0.55mm; Package Quantity: 10000; Case Code (Imperial): 0402; Termination: SMD/SMT; Max DC Current: 300mA; Radiation Hardening: No; Length: 0.039inch; Packaging: Tape and Reel; Inductance: 12nH; DC Current: 300mA; Weight: 2.3E-05oz; Case/Package: 0402; Military Standard: Not; Height: 0.5mm
L19 = CMP-06042-000668-1: Multilayer type RF Inductor 18nH ±5% 0.36Ω 400mA 0402; DC Current: 300mA; Test Frequency: 100MHz; Self Resonant Frequency: 2.2GHz; Shielding: Unshielded; Core Material: Air; DC Resistance (DCR): 360mR; Q Factor: 8; Inductance: 18nH; Military Standard: Not; REACH SVHC: No SVHC; Tolerance: 5%; Inductance Tolerance: 5%; Weight: 2.3E-05oz; Lead Free: Lead Free; Depth: 0.55mm; Current Rating: 300mA; Max DC Current: 300mA; Max Operating Temperature: 125°C; Length: 0.039inch; Min Operating Temperature: -55°C; Width: 0.5mm; Radiation Hardening: No; Termination: SMD/SMT; Height: 0.5mm; Package Quantity: 10000; Packaging: Tape and Reel; Case/Package: 0402; Case Code (Imperial): 0402; Mount: Surface Mount; Height - Seated (Max): 0.022inch; Case Code (Metric): 1005
R23 R32 R46 R48 R50 = CMP-2002-06457-1: as R94 on sheet 02-USB3
R52 R99 = CMP-2002-08122-2: RES Thick Film, 0Ω, 0.063W, 0402; Tolerance: 5%; Max Power Dissipation: 63mW; Voltage Rating: 50V; Temperature Coefficient: 100ppm/°C; Resistance: 0mR; Contact Plating: Tin; Height: 0.35mm; Radiation Hardening: No; Features: Automotive AEC-Q200; Composition: Thick Film; Width: 0.5mm; Weight: 2.3E-05oz; Termination: SMD/SMT; Packaging: Tape and Reel; Mount: Surface Mount; Case Code (Metric): 1005; Military Standard: Not; Min Operating Temperature: -55°C; Number of Terminations: 2; Package Quantity: 1; Case Code (Imperial): 0402; Depth: 0.5mm; Max Operating Temperature: 155°C; Case/Package: 0402; Power Rating: 63mW; Lead Free: Lead Free; Voltage Rating (DC): 50V; Length: 1mm
R59 = CMP-2000-03816-5: Chip Resistor, 0 Ohm, Jumper, 100 mW, -55 to 155 degC, 0603 (1608 Metric), RoHS, Tape and Reel; Manufacturer: Vishay Semiconductor; Voltage Rating: 75 V; Package Quantity: 5000; DatasheetVersion: 06/2012; Min Operating Temperature: -55 degC; ComponentLink1URL: http://www.vishay.com/; Mounting Technology: Surface Mount; Height: 0.45 mm; ComponentLink1Description: Manufacturer URL; REACH SVHC: Unknown; PackageReference: 0603; Packaging: Tape and Reel; Max Operating Temperature: 155 degC; Mount: Surface Mount; ComponentLink2Description: Datasheet; PackageDescription: 2-Pin Surface Mount Device, Body 1.575 x 0.85 mm; Length: 1.55 mm; ComponentLink2URL: http://www.vishay.com/docs/20035/dcrcwe3.pdf; Pins: 2; RoHSCompliant: true
R60-R62 = CMP-2002-07852-1: Manufacturer: Yageo; Part Number: RC0402FR-13100KL
U12 = CMP-2000-05356-1: Low Power Long Range Transceiver, 137 to 1020 MHz, -40 to 85 degC, 28-Pin QFN, RoHS, Tape and Reel; Manufacturer: Semtech; Power - Output: 20dBm; Data Rate (Max): 300kbps; Sensitivity: -148dBm; Featured Product: SX1276LongRangeTransceiver; PCN Design/Specification: CopperWire25/Mar/2014; GPIO: 6; Frequency: 137MHz~1.02GHz; Voltage - Supply: 1.8V~3.7V; Protocol: LoRa™; Current - Transmitting: 20mA~120mA; Current - Receiving: 10.8mA~12mA; Online Catalog: SX1276,SX1277andSX1278; Design Resources: SX127xReferenceDesignOverviewDevelopmentToolSelector; Serial Interfaces: SPI; Mfg Application Notes: LoRaModulation:CrystalOscillatorGuidanceSX12xxSoftwareImplementationofDataWhiteningandCRCSX127xLoRaLowEnergyDesignGuideSX127xLoRaModemDesignersGuide; Modulation: FSK,GFSK,GMSK,MSK,OOK; Other Names: SX1276IMLTRTTR; Series: -; Manufacturer URL: http://www.semtech.com/; Datasheet URL: http://www.semtech.com/images/datasheet/sx1276.pdf; Type: TxRx+MCU; RF Family/Standard: 802.15.4; Package Reference: QFN-28; Standard Package: 3,000; Package Description: 28-Pin Quad Flat No-lead Package, Body 6 x 6 mm, Pitch 0.65 mm; Category: RF/IFandRFID; Operating Temperature: -40degC~85degC; Datasheet Version: Rev. 4, 03/2015; Memory Size: -; Family: RFTransceiverICs; Packaging: Tape&Reel(TR); Package / Case: 28-VQFNExposedPad
U20-U22 = CMP-2000-05298-1: IC RF Switch SPDT, 50 Ohm, 6-Pin SC70, RoHS, Tape and Reel; Manufacturer: Peregrine Semiconductor; P1dB: 29dBm(typ)IP1dB; Topology: Reflective; Frequency - Upper: 3GHz; Insertion Loss @ Frequency: 0.5dB@2GHz; IIP3: 55dBm(typ); Voltage - Supply: 1.8V~3.3V; Other Names: 1046-1011-24259-63-ND425963PE4259PE4259SCBC-ZPE4259SCBC-Z-ND; Isolation @ Frequency: 20dB@2GHz(typ); Frequency - Lower: 10MHz; Online Catalog: PE4259; Impedance: 50Ohm; RF Type: GeneralPurpose; Series: UltraCMOS; Manufacturer URL: http://www.psemi.com/; Package Description: 6-Pin Small Outline Transistor, Body 2.05 x 1.25 mm, Pitch 0.65 mm; Family: RFSwitches; Packaging: Tape&Reel(TR); Features: Single/DualLineControl; Package / Case: 6-TSSOP,SC-88,SOT-363; Operating Temperature: -40degC~85degC; Circuit: SPDT; Supplier Device Package: SC-70-6; Standard Package: 3,000; Datasheet URL: https://datasheet.ciiva.com/15100/getdatasheetpartid-685660-15100501.pdf; Category: RF/IFandRFID; Datasheet Version: Jan-11; Package Reference: SC-70-6

## Sheet 07-TCXO_Crystal.SchDoc
size B; SheetNumber: 7; SheetTotal: 14
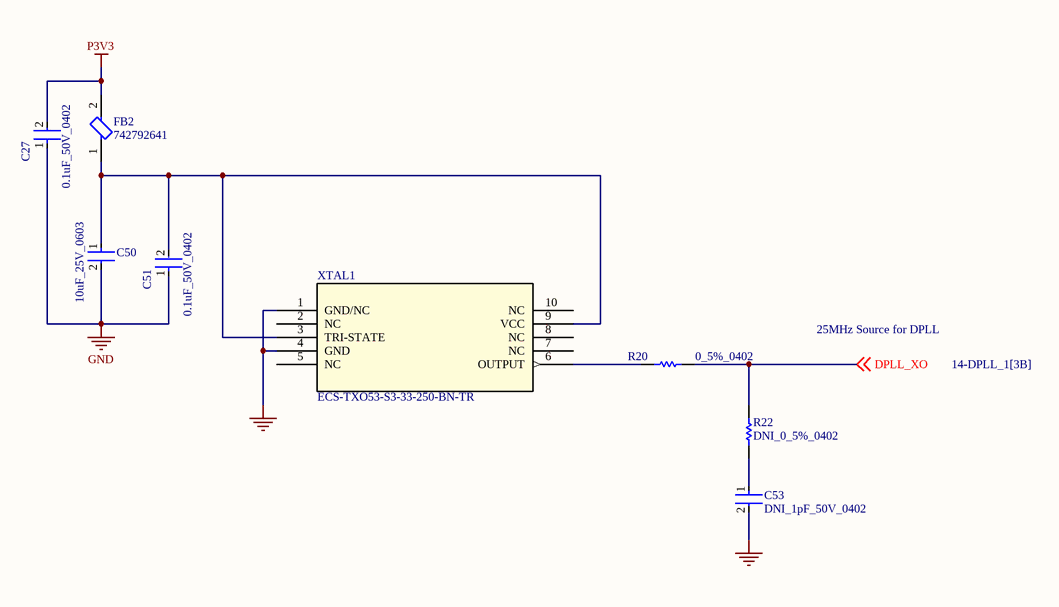
[diagram p6: 07-TCXO_Crystal.SchDoc]

### Parts
C27  0.1uF_50V_0402  [FP-C1005-050-0_05-IPC_C]
C50  10uF_25V_0603  [FP-CL10-IPC_C]
C51  0.1uF_50V_0402  [FP-C1005-050-0_05-IPC_C]
C53  DNI_1pF_50V_0402  [FP-GJM155-0_05-IPC_B]  (no BOM)
FB2  742792641  [FP-742792641-MFG]
R20  0_5%_0402  [RESC1005X40X25NL05T10]
R22  DNI_0_5%_0402  [RESC1005X40X25NL05T10]  (no BOM)
XTAL1  ECS-TXO53-S3-33-250-BN-TR  [SO10_ECS-TXO_ECS]

### Nets
GND: C27.1 C50.2 C51.1 C53.2 XTAL1.1(GND/NC) XTAL1.4(GND)
P3V3: C27.2 FB2.2
DPLL_XO: R20.2 R22.2 ; off-sheet DPLL_XO
NetC50_1: C50.1 C51.2 FB2.1 XTAL1.3(TRI-STATE) XTAL1.9(VCC)
NetC53_1: C53.1 R22.1
NetR20_1: R20.1 XTAL1.6(OUTPUT)

Not connected (* = marked no-connect by the designer): XTAL1 2(NC) 5(NC) 7(NC) 8(NC) 10(NC)

### Notes on the sheet
- 25MHz Source for DPLL

### Library data of the parts
C27 C51 = CMP-2000-05393-2: Multilayer Ceramic Capacitors 100nF ±10% 50V X7R SMD 0402; Voltage: 50V; Dielectric Material: Ceramic; Min Operating Temperature: -55°C; Depth: 0.5mm; Radiation Hardening: No; RoHS Compliant: Yes; Voltage Rating (DC): 50V; Lead Free: Lead Free; Resistor Type: Ceramic; Height: 0.5mm; Dielectric: X7R; Thickness: 0.022inch; Case/Package: 0402; Case Code (Metric): 1005; Termination: SMD/SMT; Capacitance: 100nF; Packaging: Tape and Reel; Max Operating Temperature: 125°C; Mount: Surface Mount; Package Quantity: 1; Width: 0.02inch; Weight: 2.3E-05oz; Voltage Rating: 50V; Tolerance: 10%; Construction: Flat; Case Code (Imperial): 0402; Length: 1mm; REACH SVHC: No SVHC; Series: C
C50 = CMP-13271-004224-1: as C8 on sheet 04-AT86RF215IQ; Width: 0.031inch; Voltage Rating: 25V; Length: 0.063inch; Case Code (Metric): 1608; Dielectric: X5R; Termination: Wraparound; Capacitance: 10uF; Lead Free: Lead Free; Mount: Surface Mount; Package Quantity: 1; Case Code (Imperial): 0603; Thickness: 0.035inch; Packaging: Tape and Reel; Contact Plating: Tin; Min Operating Temperature: -55°C; Tolerance: 20%; Max Operating Temperature: 85°C; Case/Package: 0603
C53 = CMP-2008-03808-2: Multi-Layer Ceramic Capacitor 1pF C0G  ±0.1pF 0402 Paper T/R; Temperature Coefficient: 30ppm/°C; Voltage Rating (DC): 50V; REACH SVHC: No SVHC; Packaging: Tape and Reel; Width: 0.02inch; Package Quantity: 10000; Min Operating Temperature: -55°C; Case Code (Imperial): 0402; Lead Pitch: 0.3mm; Capacitance: 1pF; Length: 1mm; Max Operating Temperature: 125°C; Depth: 0.5mm; Thickness: 0.022inch; Case Code (Metric): 1005; Lead Free: Lead Free; Voltage: 50V; Mount: Surface Mount; Number of Pins: 2; Termination: SMD/SMT; Radiation Hardening: No; Dielectric: C0G; Case/Package: 0402; Voltage Rating: 50V; Height: 0.5mm
FB2 = CMP-0220-00171-2: as FB3 on sheet 04-AT86RF215IQ; Case Code (Metric): 1608; Core Material: Ferrite; Length: 1.6mm; Lead Free: Lead Free; Series: WE-CBF; Min Operating Temperature: -55°C; RoHS Compliant: Yes; Case/Package: SMD/SMT; Material: Ferrite; Max Operating Temperature: 125°C; Termination: SMD/SMT; Packaging: Tape and Reel; Weight: 0.000141oz; Case Code (Imperial): 0603; Width: 0.8mm; Mount: Surface Mount; Max Current Rating: 2A; Package Quantity: 1; Depth: 0.8mm; Current Rating: 2A; Height: 0.8mm
R20 R22 = CMP-2002-06457-1: as R94 on sheet 02-USB3
XTAL1 = ECS-TXO53-S3-33-250-BN-TR: No Description Available; Mfr_Name: ECS International; Type: Oscillators; RefDes: RefDes